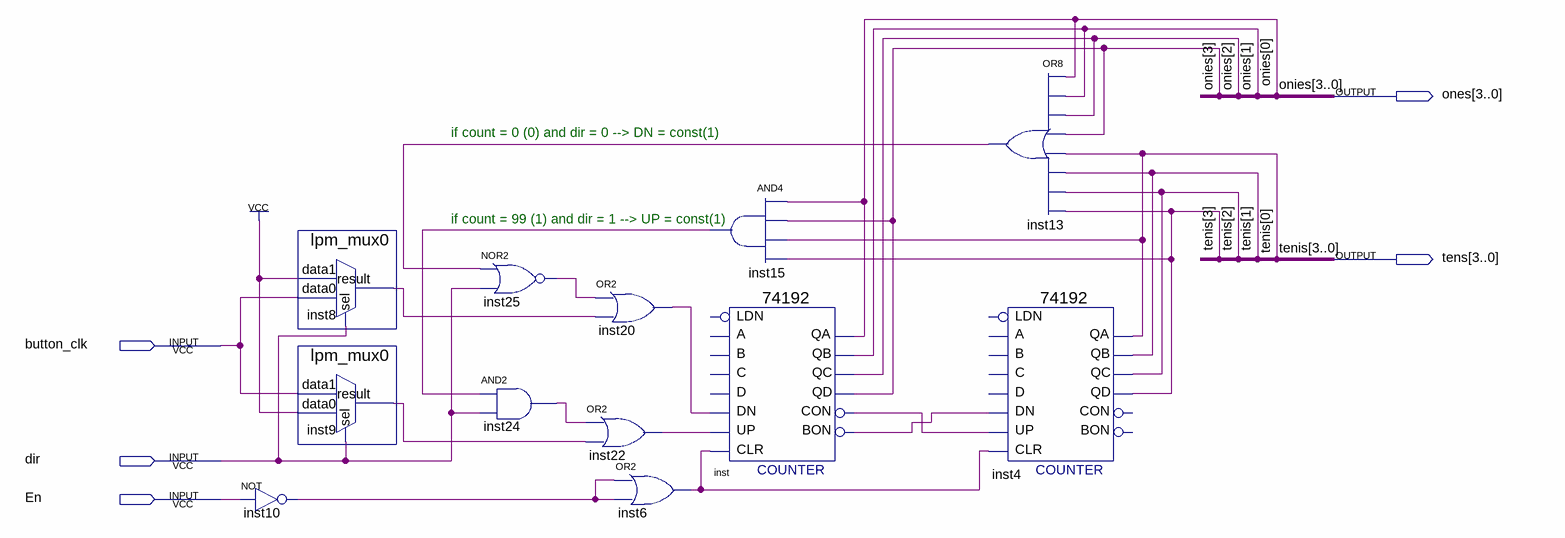
[diagram p0: schematic sheet]
// Quartus schematic counter74192_99.bdf as structural Verilog: 12 symbols, 5 pins
module counter74192_99 (
  input  button_clk,
  input  dir,
  input  En,
  output [3:0] ones,
  output [3:0] tens
);

  wire inst6_out, inst8_result, inst9_result, inst10_out, inst13_out, inst15_out, inst20_out, inst22_out,
       inst24_out, inst25_out, inst_bon, inst_con;

  not inst10 (inst10_out, En);
  lpm_mux0 inst8 (.data1(1'b1), .data0(button_clk), .sel(dir), .result(inst8_result));
  lpm_mux0 inst9 (.data1(button_clk), .data0(1'b1), .sel(dir), .result(inst9_result));
  nor inst25 (inst25_out, inst13_out, dir);
  and inst24 (inst24_out, inst15_out, dir);
  or inst20 (inst20_out, inst25_out, inst8_result);
  or inst22 (inst22_out, inst24_out, inst9_result);
  or inst6 (inst6_out, inst10_out, inst10_out);
  and inst15 (inst15_out, ones[0], ones[3], tens[0], tens[3]);
  \74192  inst (
    .CLR(inst6_out), .UP(inst22_out), .DN(inst20_out), .QB(ones[1]), .BON(inst_bon), .CON(inst_con),
    .QA(ones[0]), .QC(ones[2]), .QD(ones[3]));  // open: D, C, A, B, LDN
  or inst13 (inst13_out, ones[0], ones[1], ones[2], ones[3], tens[0], tens[1], tens[2], tens[3]);
  \74192  inst4 (
    .CLR(inst6_out), .UP(inst_con), .DN(inst_bon), .QB(tens[1]), .QA(tens[0]), .QC(tens[2]), .QD(tens[3]));  // open: D, C, A, B, LDN, BON, CON

  // Other names for the same wires on the sheet: onies[3:0] = ones; tenis[3:0] = tens

  // Notes on the sheet:
  //   if count = 0 (0) and dir = 0 --> DN = const(1)
  //   if count = 99 (1) and dir = 1 --> UP = const(1)
endmodule
